# Altium project EFNMR_POWER_V1.PrjPcb
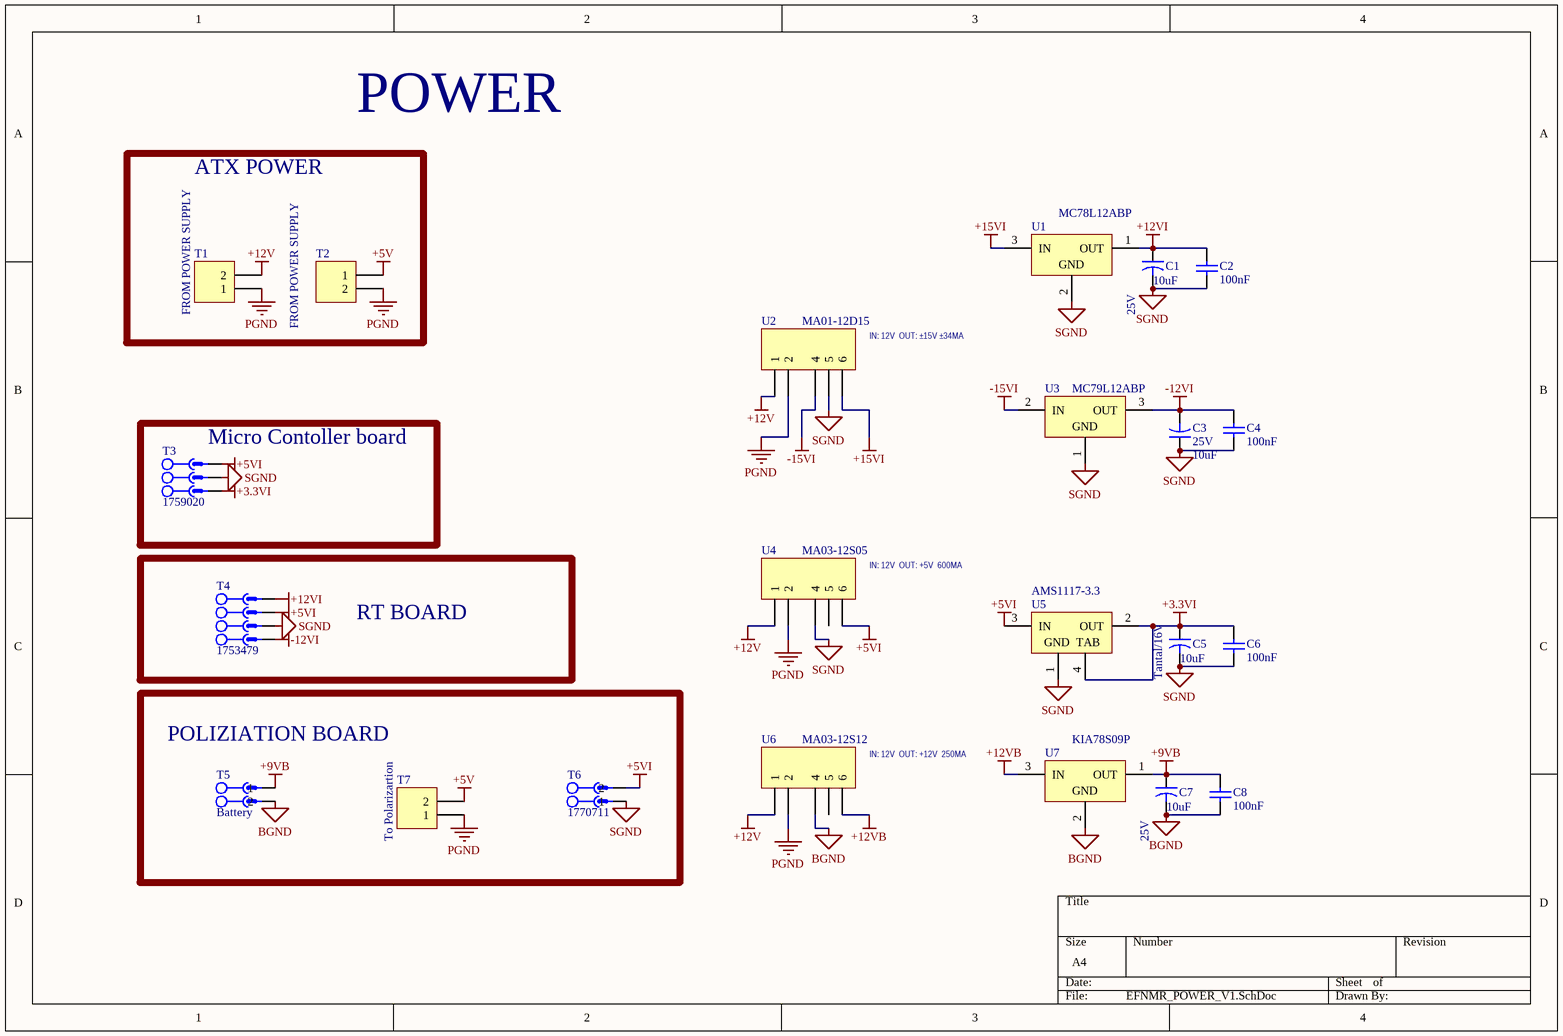
[diagram p0: EFNMR_POWER_V1.SchDoc]
1 sheet, 22 parts. Net scope: global (net labels, ports and power ports of the same name join across sheets).
Board file: EFNMR_POWER_V1.PcbDoc

## Sheet EFNMR_POWER_V1.SchDoc
size A4

### Parts
C1  25V  value 10uF  [CAP_TANTAL_TYPE_C]
C2  value 100nF  [Cap0805]  (hidden comment: Cap)
C3  25V  value 10uF  [CAP_TANTAL_TYPE_C]
C4  value 100nF  [Cap0805]  (hidden comment: Cap)
C5  Tantal/16V  value 10uF  [CAP_TANTAL_TYPE_C]
C6  value 100nF  [Cap0805]  (hidden comment: Cap)
C7  25V  value 10uF  [CAP_TANTAL_TYPE_C]
C8  value 100nF  [Cap0805]  (hidden comment: Cap)
T1  FROM POWER SUPPLY  [KF35C 2PIN]
T2  FROM POWER SUPPLY  [KF35C 2PIN]
T3  1759020  [MSTB 2,5/3-G-5,08]
T4  1753479  [MSTB 2,5/4-G-5,08]
T5  Battery  [MSTB 2,5/2-G-5,08]
T6  1770711  [MSTB 2,5/2-G-5,08]
T7  To Polarizartion  [KF35C 2PIN]
U1  MC78L12ABP  [TO-92 STR]
U2  MA01-12D15  [MA01-MINMAX]
U3  MC79L12ABP  [TO-92 STR]
U4  MA03-12S05  [MA03-S-MINIMAX]
U5  AMS1117-3.3  [SOT223_4]
U6  MA03-12S12  [MA03-S-MINIMAX]
U7  KIA78S09P  [TO-92 STR]

### Blocks framed on the sheet
ATX POWER: T1 T2
Micro Contoller board: T3
RT BOARD: T4
POLIZIATION BOARD: T5-T7

### Nets
+3.3VI: C5.1 C6.2 T3.1 U5.2(OUT) U5.4(TAB)
+5V: T2.1 T7.2
+5VI: T3.3 T4.3 T6.2 U4.6 U5.3(IN)
+9VB: C7.1 C8.2 T5.1 U7.1(OUT)
+12V: T1.2 U2.1 U4.1 U6.1
+12VB: U6.6 U7.3(IN)
+12VI: C1.1 C2.2 T4.4 U1.1(OUT)
+15VI: U1.3(IN) U2.6
-12VI: C3.2 C4.2 T4.1 U3.3(OUT)
-15VI: U2.4 U3.2(IN)
BGND: C7.2 C8.1 T5.2 U6.4 U7.2(GND)
PGND: T1.1 T2.2 T7.1 U2.2 U4.2 U6.2
SGND: C1.2 C2.1 C3.1 C4.1 C5.2 C6.1 T3.2 T4.2 T6.1 U1.2(GND) U2.5 U3.1(GND) U4.4 U5.1(GND)

Not connected (* = marked no-connect by the designer): U4 5; U6 5

### Notes on the sheet
- POWER
- (near U2) IN: 12V  OUT: ±15V ±34MA
- (near U4) IN: 12V  OUT: +5V  600MA
- IN: 12V  OUT: +12V  250MA

### Library data of the parts
C1 C3 C5 C7 = Cap2: Capacitor; Published: 23-Sep-2002; PackageReference: CAPR5-4X5; Publisher: Altium Limited; PackageDescription: Capacitor; 2 Leads
C2 C4 C6 C8 = Cap: Capacitor; Published: 8-Jun-2000; LatestRevisionDate: 17-Jul-2002; LatestRevisionNote: Re-released for DXP Platform.; PackageReference: RAD-0.3; Publisher: Altium Limited; PackageDescription: Radial Cap, Thru-Hole; 2 Leads; 0.3 in Pin Spacing
T1 T2 T7 = Header 2: Header, 2-Pin; LatestRevisionDate: 17-Jul-2002; LatestRevisionNote: Re-released for DXP Platform.; Publisher: Altium Limited
T3 = CON_Phoenix_MSTB_03: 3 Pitch: 5.08 mm Color: green Contact surface: Tin Assembly; Manufacturer: PHOENIX CONTACT; Connector type: PCB Terminal Block; designer: ABBAS BASEREH; Max Current: 12 A; Positions: 3; Voltage: 320 V; Category: Connector; ComponentLink1Description: Header, Nominal current: 12 A Rated voltage (III/2): 320 V Number of positions: 3 Pitch: 5.08 mm Color: green Contact surface: Tin Assembly: Soldering  DESIGNER:ABBAS BASEREH; ComponentLink2Description: Reference; Mounting Technology: Through-Hole; Pin Count: 3; Revision 1: 2017-3-1; Status: Unreleased; PART.NO: 1759020
T4 = CON_Phoenix_MSTBV_04: 4 Pitch: 5 mm Color: green Contact surface: Tin Assembly; Manufacturer: PHOENIX CONTACT; Connector type: PCB Terminal Block; designer: ABBAS BASEREH; Max Current: 12 A; Positions: 4; Voltage: 320 V; Category: Connector; ComponentLink1Description: Header, Nominal current: 12 A Rated voltage (III/2): 320 V Number of positions: 4 Pitch: 5 mm Color: green Contact surface: Tin Assembly: Soldering  DESIGNER:ABBAS BASEREH; ComponentLink2Description: Reference; Mounting Technology: Through-Hole; Pin Count: 4; Revision 1: 2017-3-1; Status: Unreleased; PART.NO: 1753479
T5 = CON_Phoenix_MSTB_02: 2 Pitch: 5.08 mm Color: green Contact surface: Tin Assembly; Manufacturer: PHOENIX CONTACT; PART.NO: 1770711; Connector type: PCB Terminal Block; designer: ABBAS BASEREH; Max Current: 12 A; Positions: 2; Voltage: 320 V; Category: Connector; ComponentLink1Description: Header, Nominal current: 12 A Rated voltage (III/2): 320 V Number of positions: 2 Pitch: 5.08 mm Color: green Contact surface: Tin Assembly: Soldering  DESIGNER:ABBAS BASEREH; ComponentLink2Description: Reference; Mounting Technology: Through-Hole; Pin Count: 2; Revision 1: 2017-3-1; Status: Unreleased
T6 = CON_Phoenix_MSTB_02: 2 Pitch: 5.08 mm Color: green Contact surface: Tin Assembly; Manufacturer: PHOENIX CONTACT; Connector type: PCB Terminal Block; designer: ABBAS BASEREH; Max Current: 12 A; Positions: 2; Voltage: 320 V; Category: Connector; ComponentLink1Description: Header, Nominal current: 12 A Rated voltage (III/2): 320 V Number of positions: 2 Pitch: 5.08 mm Color: green Contact surface: Tin Assembly: Soldering  DESIGNER:ABBAS BASEREH; ComponentLink2Description: Reference; Mounting Technology: Through-Hole; Pin Count: 2; Revision 1: 2017-3-1; Status: Unreleased; PART.NO: 1770711
U1 U7 = MC78L12ABP: 3-Terminal Low-Current Positive Fixed Voltage Regulator; Published: 17-Jul-2002; DatasheetVersion: 1988; PackageVersion: 1996; PackageReference: 29-04; Publisher: Altium Limited; PackageDescription: TO, Flat Index; 3 In-Line, Axial Leads; Body Dia. 4.8mm; Leads 0.48 x 0.5 mm (max); ComponentLink1Description: Manufacturer Link; ComponentLink1URL: http://www.onsemi.com/site/products/taxonomy/0,4438,503,00.html; ComponentLink2Description: Datasheet; ComponentLink2URL: http://www.onsemi.com/pub/Collateral/MC78L00A-D.PDF
U2 U4 U6 = Header 6: Header, 6-Pin; LatestRevisionDate: 17-Jul-2002; LatestRevisionNote: Re-released for DXP Platform.; Publisher: Altium Limited
U3 = MC79L12ABP: Three-Terminal Low-Current Negative Fixed Voltage Regulator; Published: 17-Jul-2002; DatasheetVersion: 1988; PackageVersion: 1996; PackageReference: 29-04; Publisher: Altium Limited; PackageDescription: TO, Flat Index; 3 In-Line, Axial Leads; Body Dia. 4.8mm; Leads 0.48 x 0.5 mm (max); ComponentLink1Description: Manufacturer Link; ComponentLink1URL: http://www.onsemi.com/site/products/taxonomy/0,4438,503,00.html; ComponentLink2Description: Datasheet; ComponentLink2URL: http://www.onsemi.com/pub/Collateral/MC79L00-D.PDF
U5 = HT1117-33_SOT223: 3.3V, 1A General Purpose LDO; DatasheetVersion: rev1.10, Mar-2008; PackageVersion: 25/05/2010; PackageReference: SOT223; PackageDescription: 4-Pin SOT-223 Package, 6.5 x 3.5 mm Body, 2.3 mm Pitch, 7 mm Lead Span; ComponentLink1Description: Manufacturer URL; ComponentLink1URL: http://www.holtek.com/; ComponentLink2Description: Datasheet; ComponentLink2URL: http://www.holtek.com/pdf/consumer/1117v110.pdf; ComponentLink3Description: Package Specification; ComponentLink3URL: http://www.holtek.com/english/literature/package.pdf